# Altium schematic sheet FLASH.SchDoc
size A
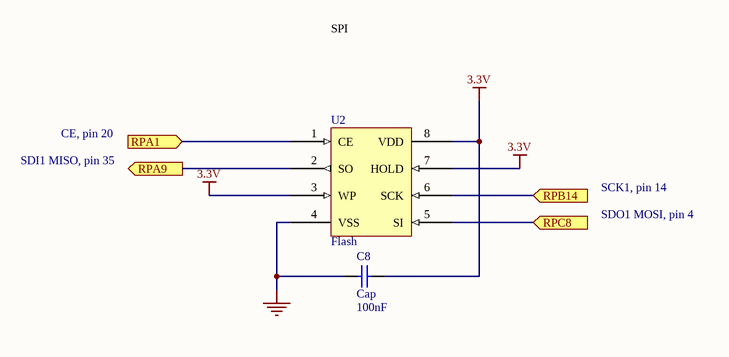
[diagram p0: FLASH.SchDoc]

## Parts
C8  Cap  value 100nF  [0603]
U2  Flash  [flash]

## Ports
RPA1 (in), RPA9 (out), RPB14 (in), RPC8 (in)

## Nets
3.3V: C8.2 U2.3(WP) U2.7(HOLD) U2.8(VDD)
GND: C8.1 U2.4(VSS)
RPA1: U2.1(CE) ; port RPA1
RPA9: U2.2(SO) ; port RPA9
RPB14: U2.6(SCK) ; port RPB14
RPC8: U2.5(SI) ; port RPC8

## Notes on the sheet
- SPI
- CE, pin 20
- SDI1 MISO, pin 35
- SCK1, pin 14
- SDO1 MOSI, pin 4

## Library data of the parts
C8 = Cap: Capacitor; Published: 8-Jun-2000; LatestRevisionDate: 17-Jul-2002; LatestRevisionNote: Re-released for DXP Platform.; PackageReference: RAD-0.3; Publisher: Altium Limited; PackageDescription: Radial Cap, Thru-Hole; 2 Leads; 0.3 in Pin Spacing
U2 = Flash: FABRIQUANT: MICROCHIP; FOURNISSEUR: FARNELL; REF FABRIQUANT: SST25VF010A-33-4C-SAE; REF FOURNISSEUR: 1829949